# EAGLE design button board v0.3.2 (EAGLE 7.3.0)
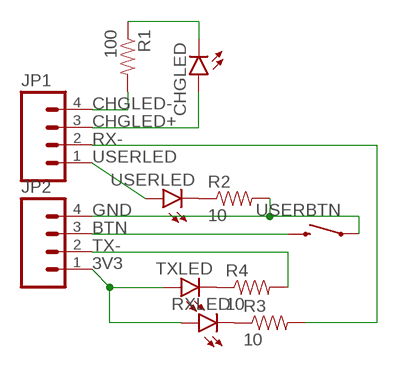
[diagram p0: schematic, sheet 1]

## Parts
CHGLED  LED-FKIT-1206  [FKIT-LED-1206]
JP1  M04PTH  [1X04]
JP2  M04PTH  [1X04]
R1  100  RESISTOR0603-RES  [0603-RES]
R2  10  RESISTOR0603-RES  [0603-RES]
R3  10  RESISTOR0603-RES  [0603-RES]
R4  10  RESISTOR0603-RES  [0603-RES]
RXLED  LED-FKIT-1206  [FKIT-LED-1206]
TXLED  LED-FKIT-1206  [FKIT-LED-1206]
USERBTN  SWITCH-MOMENTARY-2PCB_MOUNTSMD_OMRON_B3S_100X  [TACTILE_SWITCH_LARGE]
USERLED  LED-FKIT-1206  [FKIT-LED-1206]

## Nets
3V3: JP2.1 RXLED.A TXLED.A
BTN: JP2.3 USERBTN.3 USERBTN.4
CHGLED+: CHGLED.A JP1.3
CHGLED-: JP1.4 R1.2
GND: JP2.4 R2.2 USERBTN.1 USERBTN.2
N$1: CHGLED.C R1.1
N$2: R3.1 RXLED.C
N$3: R2.1 USERLED.C
N$4: R4.1 TXLED.C
RX-: JP1.2 R3.2
TX-: JP2.2 R4.2
USERLED: JP1.1 USERLED.A

## Library data of the parts
CHGLED RXLED TXLED USERLED = SparkFun-LED:LED: LEDs Standard schematic elements and footprints for 5mm, 3mm, 1206, and 0603 sized LEDs. 5mm - Spark Fun Electronics SKU : COM-00529 (and others)
JP1 JP2 = SparkFun-Connectors:M04: Header 4 Standard 4-pin 0.1" header. Use with straight break away headers (SKU : PRT-00116), right angle break away headers (PRT-00553), swiss pins (PRT-00743), machine pins (PRT-00117), and female headers (PRT-00115). Molex polarized connector foot print use with SKU : PRT-08231 with associated crimp pins and housings. 1MM SMD Version SKU: PRT-10208
R1-R4 = SparkFun-Passives:RESISTOR: Resistor Basic schematic elements and footprints for 0603, 1206, and PTH resistors.
USERBTN = comingle:SWITCH-MOMENTARY-2: Various NO switches- pushbuttons, reed, etc

## Board
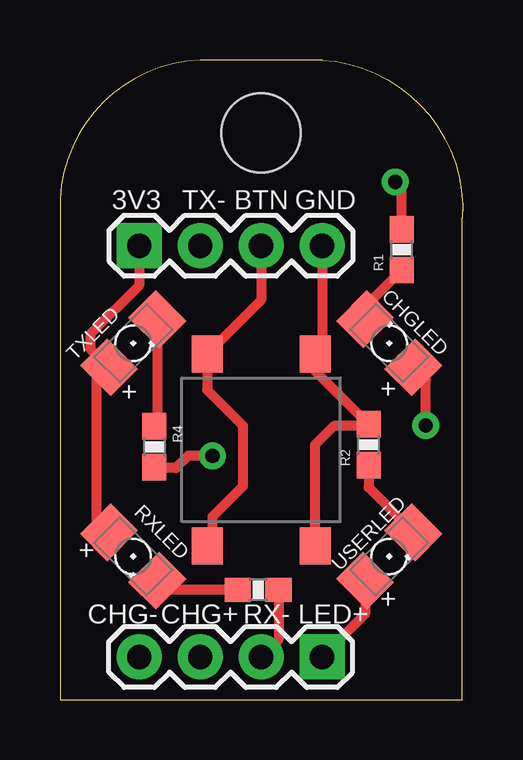
[diagram p1: board, top side]
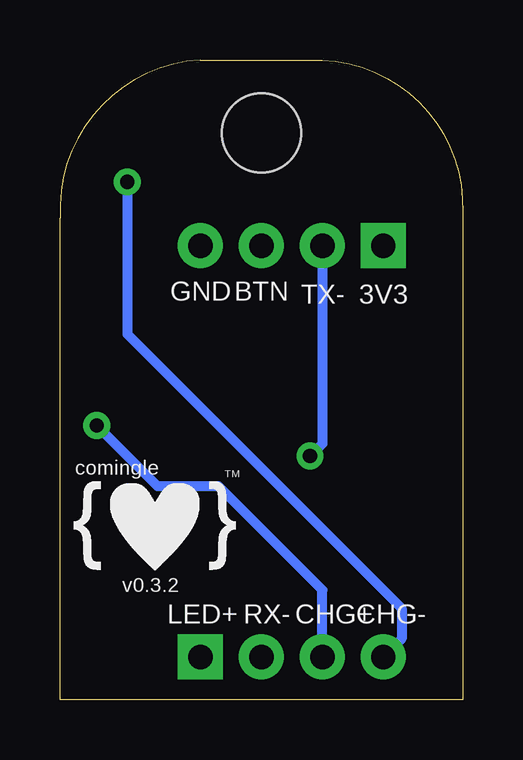
[diagram p2: board, bottom side, seen from below]

Size 16.77 x 26.67 mm. Coordinates in mm from the lower left corner, seen from the top.
Outline: 0,0 16.76,0 16.76,20.07 arc90 10.92,26.67 5.84,26.67 arc90 0,20.32 0,0
Copper layers (1*16): Top 0.035mm / dielectric 1.5mm / Bottom 0.035mm
Design rules "SparkFun-2-layer": minimum track width 7mil, minimum drill 15mil, track to track 8mil, track to pad 8mil, pad to pad 8mil, via to via 8mil, smd to smd 8mil, copper to edge 8mil, drill to drill 8mil, minimum pad ring 12mil, minimum via ring 10mil, stop-mask expansion 4mil, vias tented up to drill 20mil, thermal gap 10mil

### Footprints (pad centres in the part's own frame; a part is rotated, then mirrored left to right if it is on the bottom)
FKIT-LED-1206 = smd 1.6 x 1.803: A -1.422,0; C 1.422,0
1X04 = drill 1.016 pad 1.88 square: 1 0,0 | drill 1.016 pad 1.88: 2 2.54,0; 3 5.08,0; 4 7.62,0
0603-RES = smd 1.1 x 1: 1 -0.85,0; 2 0.85,0
STAND-OFF = hole 3.302: 0,0
TACTILE_SWITCH_LARGE = smd 1.55 x 1.3: 1 4,-2.25; 2 -4,-2.25; 3 4,2.25; 4 -4,2.25

### Placement (x,y rotation side)
CHGLED  13.72,14.86 135 top
JP1  10.92,1.78 180 top
JP2  3.3,18.92 0 top
R1  14.24,18.76 90 top
R2  12.86,10.63 90 top
R3  8.26,4.57 0 top
R4  3.94,10.54 270 top
RXLED  3.05,5.97 315 top
TXLED  3.05,14.86 45 top
U$1  [STAND-OFF]  8.38,23.62 0 top
USERBTN  8.38,10.41 90 top
USERLED  13.72,5.97 45 top

### Tracks (layer width: path | path; a pad name or v marks a point on that pad's centre or on a via)
3V3
  Top 0.406: JP2.1 3.3,17.27 1.27,15.24 1.27,14.63 TXLED.A 1.52,13.34 1.52,7.49 RXLED.A
BTN
  Top 0.406: JP2.3 8.38,16.66 USERBTN.3 6.13,12.92 7.62,11.43 7.62,8.89 6.35,7.62 6.35,6.63 USERBTN.4
CHGLED+  (via drill 0.6)
  Top 0.406: v15.24,11.43 15.24,13.34 CHGLED.A
  Bottom 0.406: JP1.3 5.84,4.57 10.16,8.89 12.7,8.89 v15.24,11.43
CHGLED-  (via drill 0.6)
  Top 0.406: R1.2 14.24,21.32 v13.97,21.59
  Bottom 0.406: v13.97,21.59 13.97,15.24 2.54,3.81 2.54,2.54 JP1.4
GND
  Top 0.406: JP2.4 10.92,14.7 USERBTN.1 10.63,13.7 R2.2 12.81,11.43 11.43,11.43 10.63,10.63 USERBTN.2
N$1
  Top 0.406: CHGLED.C 12.71,16.38 R1.1
N$2
  Top 0.406: R3.1 4.45,4.57 RXLED.C
N$3
  Top 0.406: R2.1 12.86,8.84 USERLED.C
N$4
  Top 0.406: TXLED.C 4.05,11.51 R4.1
RX-
  Top 0.406: R3.2 9.11,2.5 JP1.2
TX-  (via drill 0.6)
  Top 0.406: v6.35,10.16 5.33,10.16 4.83,9.65 3.98,9.65 R4.2
  Bottom 0.406: JP2.2 5.84,10.67 v6.35,10.16
USERLED
  Top 0.406: USERLED.A 12.71,3.57 JP1.1

### Text on the board
tPlace: 3V3 | TX- | BTN | GND | + | + | + | + | CHG- | CHG+ | RX- | LED+
bPlace: 3V3 | TX- | BTN | GND | TM | comingle | v0.3.2 | CHG- | CHG+ | RX- | LED+